# Altium schematic sheet bmsMaster_isospi.SchDoc
size A; SheetNumber: 5; SheetTotal: 7
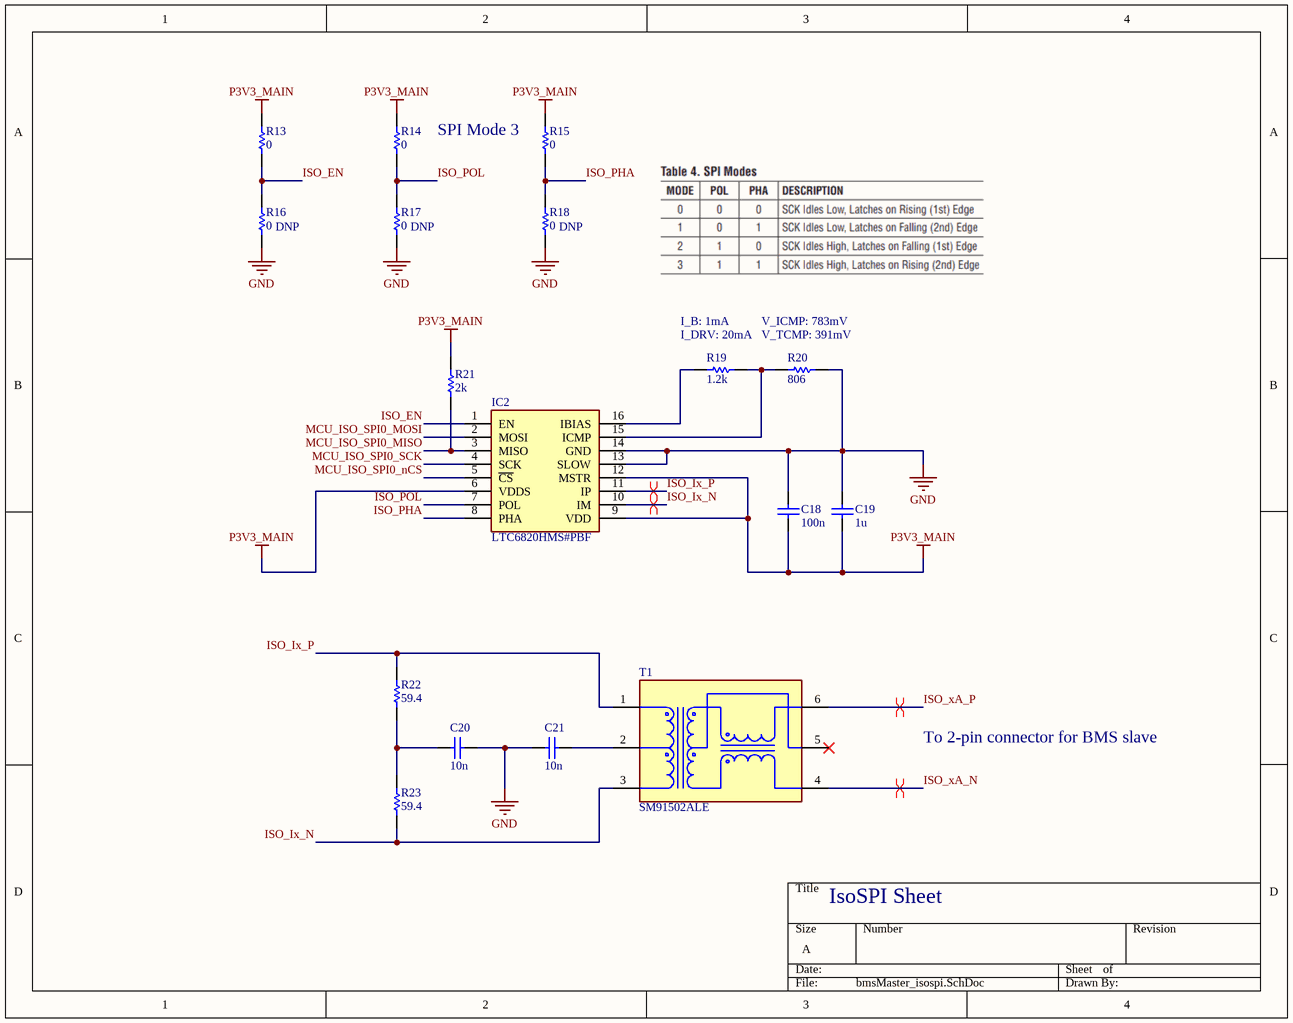
[diagram p0: bmsMaster_isospi.SchDoc]

## Parts
C18  value 100n  (hidden comment: Capacitor)
C19  value 1u  (hidden comment: Capacitor)
C20  value 10n  (hidden comment: Capacitor)
C21  value 10n  (hidden comment: Capacitor)
IC2  LTC6820HMS#PBF  [SOP50P490X110-16N]
R13  value 0  (hidden comment: Resistor)
R14  value 0  (hidden comment: Resistor)
R15  value 0  (hidden comment: Resistor)
R16  value 0  (hidden comment: Resistor)
R17  value 0  (hidden comment: Resistor)
R18  value 0  (hidden comment: Resistor)
R19  value 1.2k  (hidden comment: Resistor)
R20  value 806  (hidden comment: Resistor)
R21  value 2k  (hidden comment: Resistor)
R22  value 59.4  (hidden comment: Resistor)
R23  value 59.4  (hidden comment: Resistor)
T1  SM91502ALE  [FP-SM91502ALE-MFG]

## Nets
GND: C18.2 C19.2 C20.1 C21.1 IC2.13(SLOW) IC2.14(GND) R16.1 R17.1 R18.1 R20.2
P3V3_MAIN: C18.1 C19.1 IC2.6(VDDS) IC2.9(VDD) IC2.12(MSTR) R13.2 R14.2 R15.2 R21.2
ISO_EN: IC2.1(EN) R13.1 R16.2
ISO_Ix_N: IC2.10(IM) R23.1 T1.3
ISO_Ix_P: IC2.11(IP) R22.2 T1.1
ISO_PHA: IC2.8(PHA) R15.1 R18.2
ISO_POL: IC2.7(POL) R14.1 R17.2
ISO_xA_N: T1.4
ISO_xA_P: T1.6
MCU_ISO_SPI0_MISO: IC2.3(MISO) R21.1
MCU_ISO_SPI0_MOSI: IC2.2(MOSI)
MCU_ISO_SPI0_nCS: IC2.5(~{CS})
MCU_ISO_SPI0_SCK: IC2.4(SCK)
NetC20_2: C20.2 R22.1 R23.2
NetC21_2: C21.2 T1.2
NetIC2_15: IC2.15(ICMP) R19.2 R20.1
NetIC2_16: IC2.16(IBIAS) R19.1

Not connected (* = marked no-connect by the designer): T1 5*

## Layout directives
differential pair: ISO_Ix_N, ISO_Ix_P, ISO_xA_N, ISO_xA_P

## Notes on the sheet
- (near R15) SPI Mode 3
- (near R16) DNP
- (near R17) DNP
- (near R18) DNP
- (near R19) I_B: 1mA
- (near R19) I_DRV: 20mA
- V_ICMP: 783mV
- V_TCMP: 391mV
- To 2-pin connector for BMS slave
- IsoSPI Sheet

## Library data of the parts
C18-C21 = Capacitor: SimulationGenericComponent: True
IC2 = LTC6820HMS#PBF: Integrated Circuit; Manufacturer_Name: Analog Devices; Datasheet Link: https://www.analog.com/media/en/technical-documentation/data-sheets/LTC6820.pdf; Height: 1.1mm; Manufacturer_Part_Number: LTC6820HMS#PBF; Mouser Part Number: 584-LTC6820HMS#PBF; Mouser Price/Stock: https://www.mouser.co.uk/ProductDetail/Analog-Devices/LTC6820HMSPBF?qs=hVkxg5c3xu%252BAhS55eUb%252BEQ%3D%3D; Arrow Part Number: LTC6820HMS#PBF; Arrow Price/Stock: https://www.arrow.com/en/products/ltc6820hmspbf/analog-devices?region=europe
R13-R18 = Resistor: SimulationGenericComponent: True; TC1: 0; TC2: 0
R19-R23 = Resistor: TC1: 0; SimulationGenericComponent: True; TC2: 0
T1 = CMP-07264-000001-1: BMS XFORMER 1-CH 1000V AECQ +125; Manufacturer: Bourns; Standoff Height: 0.13mm; Turns Ratio: 1:1; Automotive Grade: Grade 1; Isolation Voltage: 4300VDC; Return Loss: -22dB; Insertion Loss: -0.25dB; Height: 5.72mm; Automotive: Yes; Package: 0; Device Class L3: unset; ComponentLink2Description: Datasheet; Category: Trans; ComponentLink2URL: https://www.bourns.com/docs/product-datasheets/SM91502AL.pdf; Device Class L1: Passive Components; Manufacturer Part Number: SM91502ALE; Temperature Range High: +125°C; Digikey Description: BMS XFORMER 1-CH 1000V AECQ +125; RoHS: TRUE; Lead Free: Yes; Octopart: https://octopart.com/sm91502ale-bourns-95732123; Device Class L2: Transformers; Temperature: -40°C to +125°C; Temperature Range Low: -40°C